# Altium schematic sheet 8_Lights.SchDoc
size A4; SheetNumber: 9; SheetTotal: 13
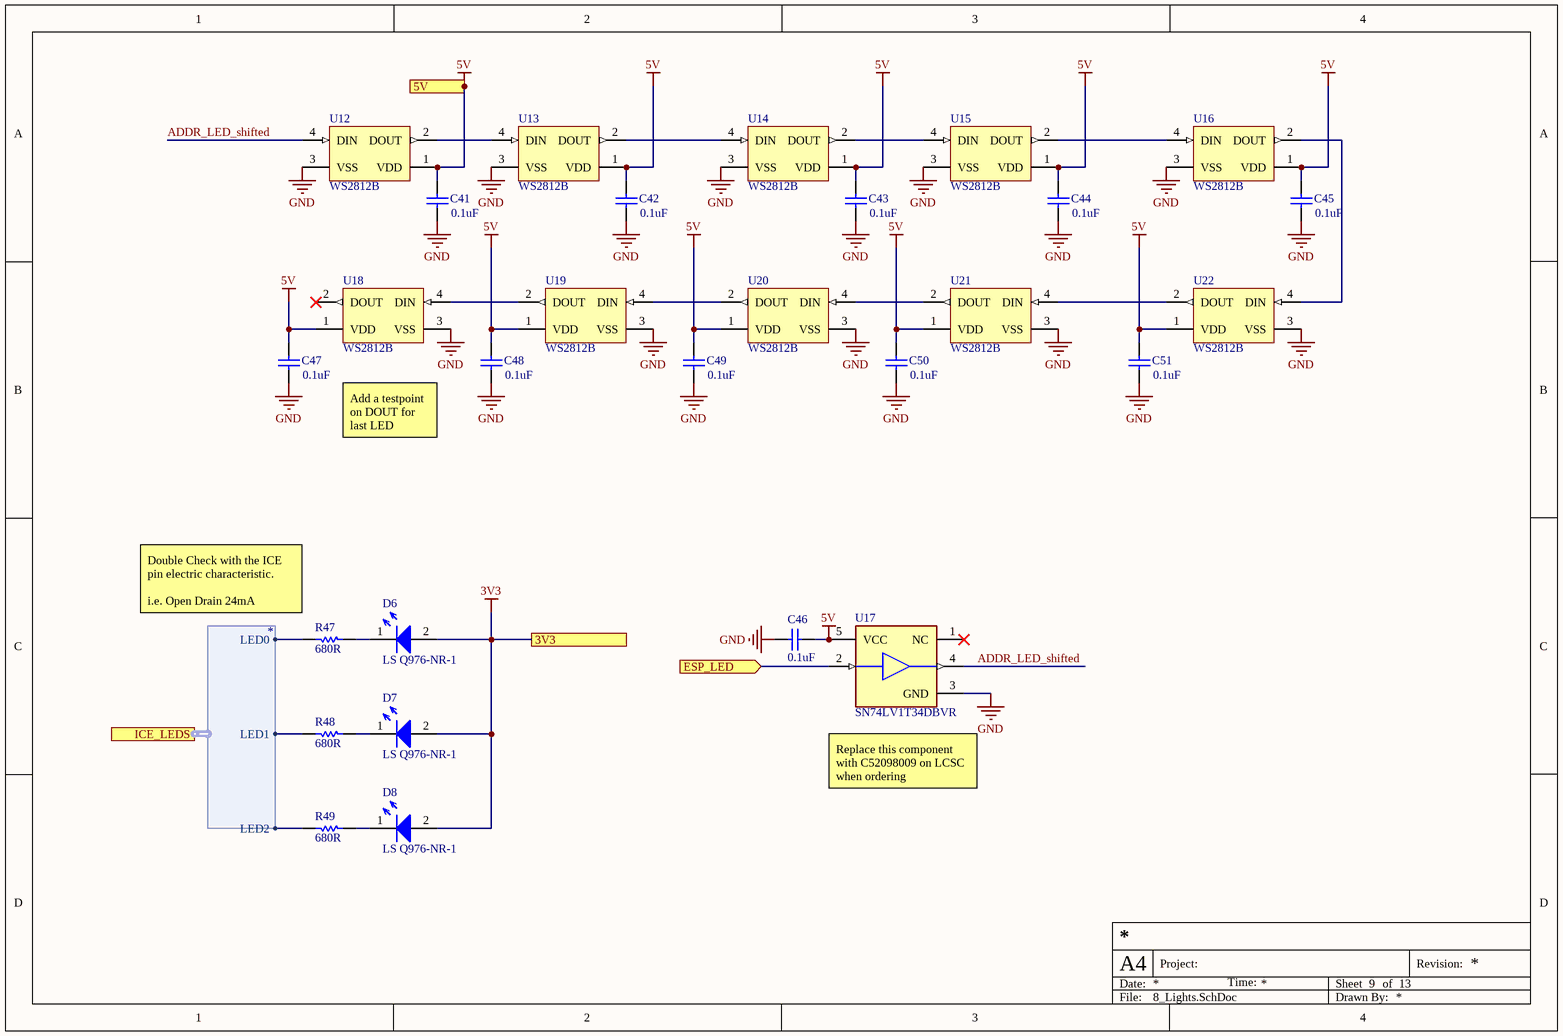
[diagram p0: 8_Lights.SchDoc]

## Parts
C41  0.1uF  [CAPC1609X100X15NL20]
C42  0.1uF  [CAPC1609X100X15NL20]
C43  0.1uF  [CAPC1609X100X15NL20]
C44  0.1uF  [CAPC1609X100X15NL20]
C45  0.1uF  [CAPC1609X100X15NL20]
C46  0.1uF  [CAPC1609X100X15NL20]
C47  0.1uF  [CAPC1609X100X15NL20]
C48  0.1uF  [CAPC1609X100X15NL20]
C49  0.1uF  [CAPC1609X100X15NL20]
C50  0.1uF  [CAPC1609X100X15NL20]
C51  0.1uF  [CAPC1609X100X15NL20]
D6  LS Q976-NR-1  [LED0603]
D7  LS Q976-NR-1  [LED0603]
D8  LS Q976-NR-1  [LED0603]
R47  680R  [RESC1609X55X30NL10T20]
R48  680R  [RESC1609X55X30NL10T20]
R49  680R  [RESC1609X55X30NL10T20]
U12  WS2812B  [ADAI-WS2812B_V]
U13  WS2812B  [ADAI-WS2812B_V]
U14  WS2812B  [ADAI-WS2812B_V]
U15  WS2812B  [ADAI-WS2812B_V]
U16  WS2812B  [ADAI-WS2812B_V]
U17  SN74LV1T34DBVR  [FP-DBV0005A-IPC_B]
U18  WS2812B  [ADAI-WS2812B_V]
U19  WS2812B  [ADAI-WS2812B_V]
U20  WS2812B  [ADAI-WS2812B_V]
U21  WS2812B  [ADAI-WS2812B_V]
U22  WS2812B  [ADAI-WS2812B_V]

## Ports
3V3, 5V, ESP_LED (in), ICE_LEDS (harness *)

## Harnesses
*: LED2, LED0, LED1

## Nets
3V3: D6.2(Anode) D7.2(Anode) D8.2(Anode) ; port 3V3
5V: C41.2 C42.2 C43.2 C44.2 C45.2 C46.1 C47.2 C48.2 C49.2 C50.2 C51.2 U12.1(VDD) U13.1(VDD) U14.1(VDD) U15.1(VDD) U16.1(VDD) U17.5(VCC) U18.1(VDD) U19.1(VDD) U20.1(VDD) U21.1(VDD) U22.1(VDD) ; port 5V
GND: C41.1 C42.1 C43.1 C44.1 C45.1 C46.2 C47.1 C48.1 C49.1 C50.1 C51.1 U12.3(VSS) U13.3(VSS) U14.3(VSS) U15.3(VSS) U16.3(VSS) U17.3(GND) U18.3(VSS) U19.3(VSS) U20.3(VSS) U21.3(VSS) U22.3(VSS)
ADDR_LED_shifted: U12.4(DIN) U17.4(Y)
ESP_LED: U17.2(A) ; port ESP_LED
NetD6_1: D6.1(Cathode) R47.1
NetD7_1: D7.1(Cathode) R48.1
NetD8_1: D8.1(Cathode) R49.1
NetR47_2: R47.2 ; port ICE_LEDS.LED0
NetR48_2: R48.2 ; port ICE_LEDS.LED1
NetR49_2: R49.2 ; port ICE_LEDS.LED2
NetU12_2: U12.2(DOUT) U13.4(DIN)
NetU13_2: U13.2(DOUT) U14.4(DIN)
NetU14_2: U14.2(DOUT) U15.4(DIN)
NetU15_2: U15.2(DOUT) U16.4(DIN)
NetU16_2: U16.2(DOUT) U22.4(DIN)
NetU18_4: U18.4(DIN) U19.2(DOUT)
NetU19_4: U19.4(DIN) U20.2(DOUT)
NetU20_4: U20.4(DIN) U21.2(DOUT)
NetU21_4: U21.4(DIN) U22.2(DOUT)

Not connected (* = marked no-connect by the designer): U17 1(NC)*; U18 2(DOUT)*

## Notes on the sheet
- Add a testpoint on DOUT for last LED
- (near R47) Double Check with the ICE pin electric characteristic.
  i.e. Open Drain 24mA
- (near U17) Replace this component with C52098009 on LCSC when ordering
- Date:
- A4
- Project:
- Time:
- Sheet
- of
- Revision:
- File:
- Drawn By:

## Library data of the parts
C41-C51 = CMP-2006-00183-1: Manufacturer: AVX Interconnect / Elco; Part Number: TACL105K006XTA
D6-D8 = CMP-029-000016-3: LED RED DIFFUSED 0603 SMD; Manufacturer: OSRAM Opto Semiconductors Inc.; Voltage - Forward Max: 2V; Current - Average: 20mA; Supplier 1: Digi-Key; Package: 0603 (1608 Metric); Type: LED; Supplier Part Number 1: 475-2512-1-ND; ComponentLink1Description: Datasheet; Color: Red; ComponentLink1URL: https://dammedia.osram.info/media/resource/hires/osram-dam-2493499/LS%20Q976.pdf; PN: LS Q976-NR-1
R47-R49 = CMP-2000-03692-1: Manufacturer: Vishay Dale; Part Number: TNPW060310K0BEEN
U12-U16 U18-U22 = CMP-007-00035-2: Intelligent Control LED Integrated Light Source, 3.5 to 5.3 V, -25 to 80 degC, 4-Pin SMD, RoHS, Bulk; Manufacturer: Adafruit Industries; Datasheet URL: https://cdn-shop.adafruit.com/datasheets/WS2812B.pdf; Manufacturer URL: https://www.adafruit.com/; Datasheet Version: May-13; Case/Package: WS2812B; Mounting Technology: SM; RoHS Compliant: False; Package Description: 4-Pin Surface Mount Device, Body 5 x 5 mm, Pitch 3.3 mm; Package Reference: WS2812B
U17 = CMP-0859-00123-4: IC BUF NON-INVERT 5.5V SOT23-5; Low Level Output Current: 8mA; Polarity: Non-Inverting; Number of Channels: 1; Propagation Delay: 15.5ns; High Level Output Current: -8mA; Quiescent Current: 1uA; Logic Function: Buffer; Min Supply Voltage: 1.6V; Min Operating Temperature: -40°C; Package Quantity: 3000; Max Operating Temperature: 125°C; Operating Supply Current: 8mA; Radiation Hardening: No; REACH SVHC: No SVHC; Number of Bits per Element: 1; Mount: Surface Mount; Number of Outputs: 1; Lead Free: Lead Free; Number of Pins: 5; Weight: 0.000353oz; Number of Output Lines: 1; Number of Elements: 1; Number of Input Lines: 1; Number of Bits: 1; Case/Package: SOT-23-5; Packaging: Tape and Reel; Max Supply Voltage: 5.5V; Number of Inputs: 1